# Altium schematic sheet 1 - Power.SchDoc
size A4
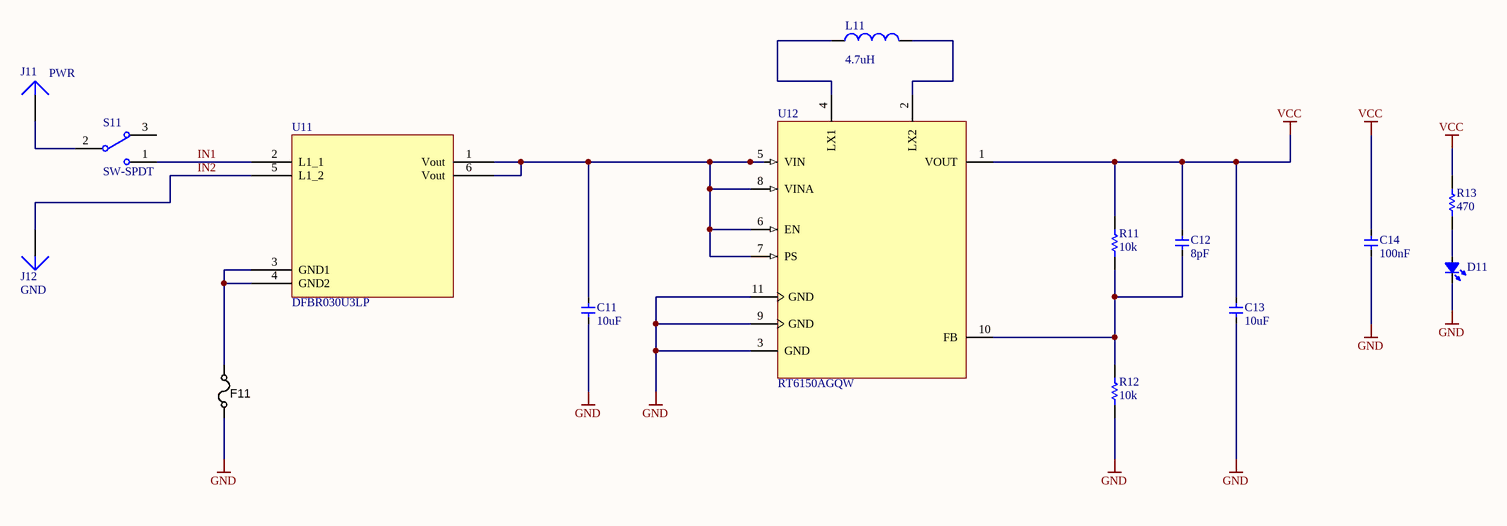
[diagram p0: 1 - Power.SchDoc]

## Parts
C11  value 10uF  [CAPC2012X135N]  (hidden comment: Cap_0603)
C12  value 8pF  [CAP_0603]  (hidden comment: Cap_0603)
C13  value 10uF  [CAPC2012X135N]  (hidden comment: Cap_0603)
C14  value 100nF  [CAP_0603]  (hidden comment: Cap_0603)
D11  LED_0603  [LED_0603_RED]  (value not drawn)
F11  Slow-blow  [RESC3216X70N]  (value not drawn)
J11  PWR  [PIN1]
J12  GND  [PIN1]
L11  value 4.7uH  [RES_0805]  (hidden comment: Inductor)
R11  value 10k  [RES_0603]  (hidden comment: Res1)
R12  value 10k  [RES_0603]  (hidden comment: Res1)
R13  value 470  [RES_0603]  (hidden comment: Res1)
S11  SW-SPDT  [MSK-12C02]
U11  DFBR030U3LP  [U-DFN4040-8]
U12  RT6150AGQW  [DFN-MF10]

## Nets
GND: C11.1 C13.1 C14.1 D11.2(K) F11.1 R12.1 U12.3(GND) U12.9(GND) U12.11(GND)
VCC: C12.2 C13.2 C14.2 R11.2 R13.2 U12.1(VOUT)
IN1: S11.1 U11.2(L1_1)
IN2: J12.1 U11.5(L1_2)
NetC11_2: C11.2 U11.1(Vout) U11.6(Vout) U12.5(VIN) U12.6(EN) U12.7(PS) U12.8(VINA)
NetC12_1: C12.1 R11.1 R12.2 U12.10(FB)
NetD11_1: D11.1(A) R13.1
NetF11_2: F11.2 U11.3(GND1) U11.4(GND2)
NetJ11_1: J11.1 S11.2
NetL11_1: L11.1 U12.4(LX1)
NetL11_2: L11.2 U12.2(LX2)

Not connected (* = marked no-connect by the designer): S11 3

## Library data of the parts
C11-C14 = Cap_0603: Capacitor
D11 = LED_0603: LED
F11 = FUSE_160mA_1206: Fuse 750mA 6VDC 1206 SMD; Manufacturer 1: TE Connectivity; Manufacturer Part Number 1: NANOSMDC075F-2; Ratings: 750mA; 6VDC; slow-blow; SCDType: spec; Package / Case: 1206 (3216 metric); Value: 750mA
J11 J12 = Plug: LatestRevisionDate: 17-Jul-2002; LatestRevisionNote: Re-released for DXP Platform.; Publisher: Altium Limited
L11 = Inductor: Code_IEC: 2012; Published: 8-Jun-2000; LatestRevisionDate: 29-May-2009; LatestRevisionNote: IPC-7351 Footprint Added.; PackageReference: 0402-A; Publisher: Altium Limited; PackageDescription: Chip Inductor; Code_JEITA: 0805
R11-R13 = Res1: Resistor; Published: 8-Jun-2000; LatestRevisionDate: 17-Jul-2002; LatestRevisionNote: Re-released for DXP Platform.; PackageReference: AXIAL-0.3; Publisher: Altium Limited; PackageDescription: Axial Device, Thru-Hole; 2 Leads; 0.3 in Pin Spacing
S11 = SW-SPDT: SPDT Subminiature Toggle Switch, Right Angle Mounting, Vertical Actuation; Published: 24-Mar-1999; LatestRevisionDate: 17-Dec-2003; LatestRevisionNote: Schematic revised, PCB Footprint replaced.; DatasheetVersion: 05-Dec-2000; PackageReference: TL36WW15050; Publisher: Altium Limited; PackageDescription: Switch; 4 Leads; ComponentLink1Description: Manufacturer Link; ComponentLink1URL: http://www.apem.com
U11 = DFBR030U3LP: 3A Full Bridge Rectifier
U12 = RT6150AGQW: Buck-Boost Switching Regulator IC Positive Adjustable 1.8V 1 Output 800mA 10-WFDFN Exposed Pad; PackageReference: 10-WDFN (3x3); PackageDescription: 10-WFDFN Exposed Pad; Supplier 1: Digi-Key; Supplier Part Number 1: 1028-1259-1-ND; ComponentLink1Description: Datasheet; ComponentLink1URL: http://www.richtek.com/assets/product_file/RT6150A=RT6150B/DS6150AB-05.pdf; ComponentLink2Description: Packaging Specification